# Altium project SLEEPTRACK2_PHASE3.PrjPcb
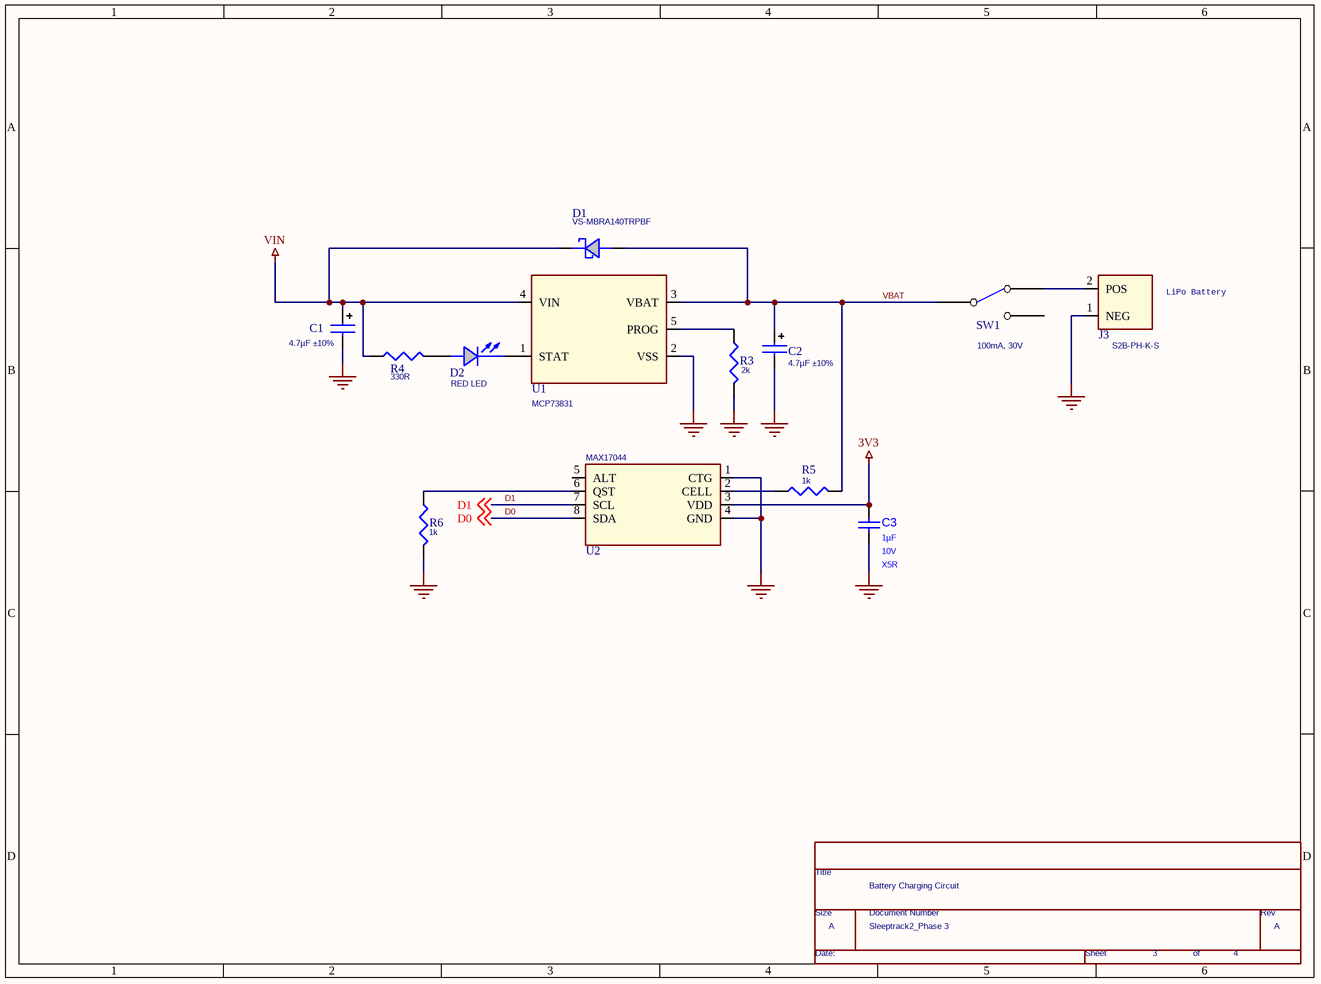
[diagram p0: P03_Battery Circuit.SchDoc]
8 sheets, 44 parts. Net scope: global (net labels, ports and power ports of the same name join across sheets).
Sheets:
  P03_Battery Circuit.SchDoc
  P01_Title .SchDoc
  P02_Photon.SchDoc
  P04_Connectors.SchDoc
  P05_BNO055.SchDoc
  P06_Audio .SchDoc
  P07_ BNO055 External.SchDoc
  P08_BNO055 TH.SchDoc

## Sheet P03_Battery Circuit.SchDoc
size 246 x 182 mm

### Parts
(Parts that share a designator on the sheet are numbered #1, #2 ... from top to bottom, then left to right.)
*#1  Doc: Sleeptrack2_Phase 3  RevCode: A  Title: Battery Charging Circuit  Page Number: 3  Page Count: 4  (hidden comment: TitleBlock0)  (graphical)
C1  4.7µF ±10%  [CAPCP1206]
C2  4.7µF ±10%  [CAPCP1206]
C3  ValueDisplayed: 1µF  Value2: 10V  TempCo: X5R  [0402]  (hidden comment: GRM155R61A105KE15D)
D1  VS-MBRA140TRPBF  [D0-214AC]
D2  RED LED  [LED0402N]
J3  S2B-PH-K-S  [S2B-PH-K-S]
R3  2k  [RESC402N]
R4  330R  [RESC402N]
R5#1  1k  [RESC402N]
R6#1  1k  [RESC402N]
SW1  100mA, 30V  [SS12DH2]
U1  MCP73831  [SOT95P270X145-5N]
U2  MAX17044  [SON50P300X100_HS-9M]

### Nets
3V3: C1.2 C2.2 C3.1 C3.2 J3.1(NEG) R3.2 R6#1.2 U1.2(VSS) U2.1(CTG) U2.3(VDD) U2.4(GND)  [also labelled GND]
VIN: C1.1 D1.2(CATHODE) R4.1 U1.4(VIN)  [project net Photon_VIN]
D0: U2.8(SDA) ; off-sheet D0
D1: U2.7(SCL) ; off-sheet D1
VBAT: C2.1 D1.1(ANODE) R5#1.2 SW1.1(COMMON) U1.3(VBAT)
NetD2_1: D2.1(CATHODE) U1.1(STAT)
NetD2_2: D2.2(ANODE) R4.2
NetJ3_2: J3.2(POS) SW1.3(NO)
NetR3_1: R3.1 U1.5(PROG)
NetR5#1_1: R5#1.1 U2.2(CELL)
NetR6#1_1: R6#1.1 U2.6(QST)

Not connected (* = marked no-connect by the designer): SW1 2(NC); U2 5(ALT)

### Notes on the sheet
- LiPo Battery
- (in symbol TitleBlock0) Title; Size; Document Number; Rev; Date:; Sheet; of

### Library data of the parts
C1 C2 = 4.7µF ±10% Molded Tantalum Capacitors 6.3V 1206 (3216 Metric) 6 Ohm: T491A475K006AT
C3 = GRM155R61A105KE15D: CAP, CERM, 1 µF, 10 V, +/- 10%, X5R, 0402; Manufacturer: MuRata; Polarized: N; CompType: Capacitor; Value: 1uF; U/M: EA; Cap_F: 0.000001; Tolerance_%: 10; Value1: Unknown; TaMin_C: -55; TaMax_C: 85; AEC Category: Q200; SymbolVersion: 2008-07-09; PartNumber: GRM155R61A105KE15D; PackageReference: 0402; RoHS: Y; VDC_V: 10; MountType: SMT; Technology: Ceramic; Cap_Case: 0402; Published: 2008-06-19; Publisher: Texas Instruments; LatestRevisionDate: 2016-01-22; ComponentLink1Description: Datasheet link; ComponentLink1URL: http://search.murata.co.jp/Ceramy/PnsearchViewAction.do?HnOFG=ON&HnNFG=ON&SEL_CNT=50&sLang=en&sKey=GRM155R61A105KE15D&x=9&y=9&search=startwith; Supplier 1: Digi-Key; Supplier Part Number 1: 490-3890-1-ND; Supplier 2: Mouser; Supplier Part Number 2: 81-GRM155R61A105KE15; Supplier 3: Farnell; Supplier Part Number 3: 1735523; AEC Qualified: ?
D1 = VS-MBRA140TRPBF: Diode Schottky 40V 1A Surface Mount SMA
D2 = VLMS1500-GS08: Red 631nm LED Indication - Discrete 2V 0402 (1005 Metric)
J3 = S2B-PH-K-S: 2 Positions Header, Shrouded Connector 0.079" (2.00mm) Through Hole, Right Angle Tin
R3 = RC0402FR-072KL: RES SMD 2K OHM 1% 1/16W 0402
R4 = RC0402FR-07330RL: RES SMD 330R OHM 1% 1/16W 0402
R5#1 R6#1 = RC0402FR-071KL: RES SMD 1K OHM 1% 1/16W 0402
SW1 = SS12SDH2: Slide Switch SPDT Through Hole, Right Angle
U1 = MCP73831: Charger IC Lithium-Ion/Polymer SOT-23-5
U2 = MAX17044: Battery Battery Monitor IC Lithium-Ion/Polymer 8-TDFN (2x3)
*#1 = TitleBlock0: Page Create Date: March  8, 1995; Page Size: A

## Sheet P01_Title .SchDoc
size 386 x 246 mm
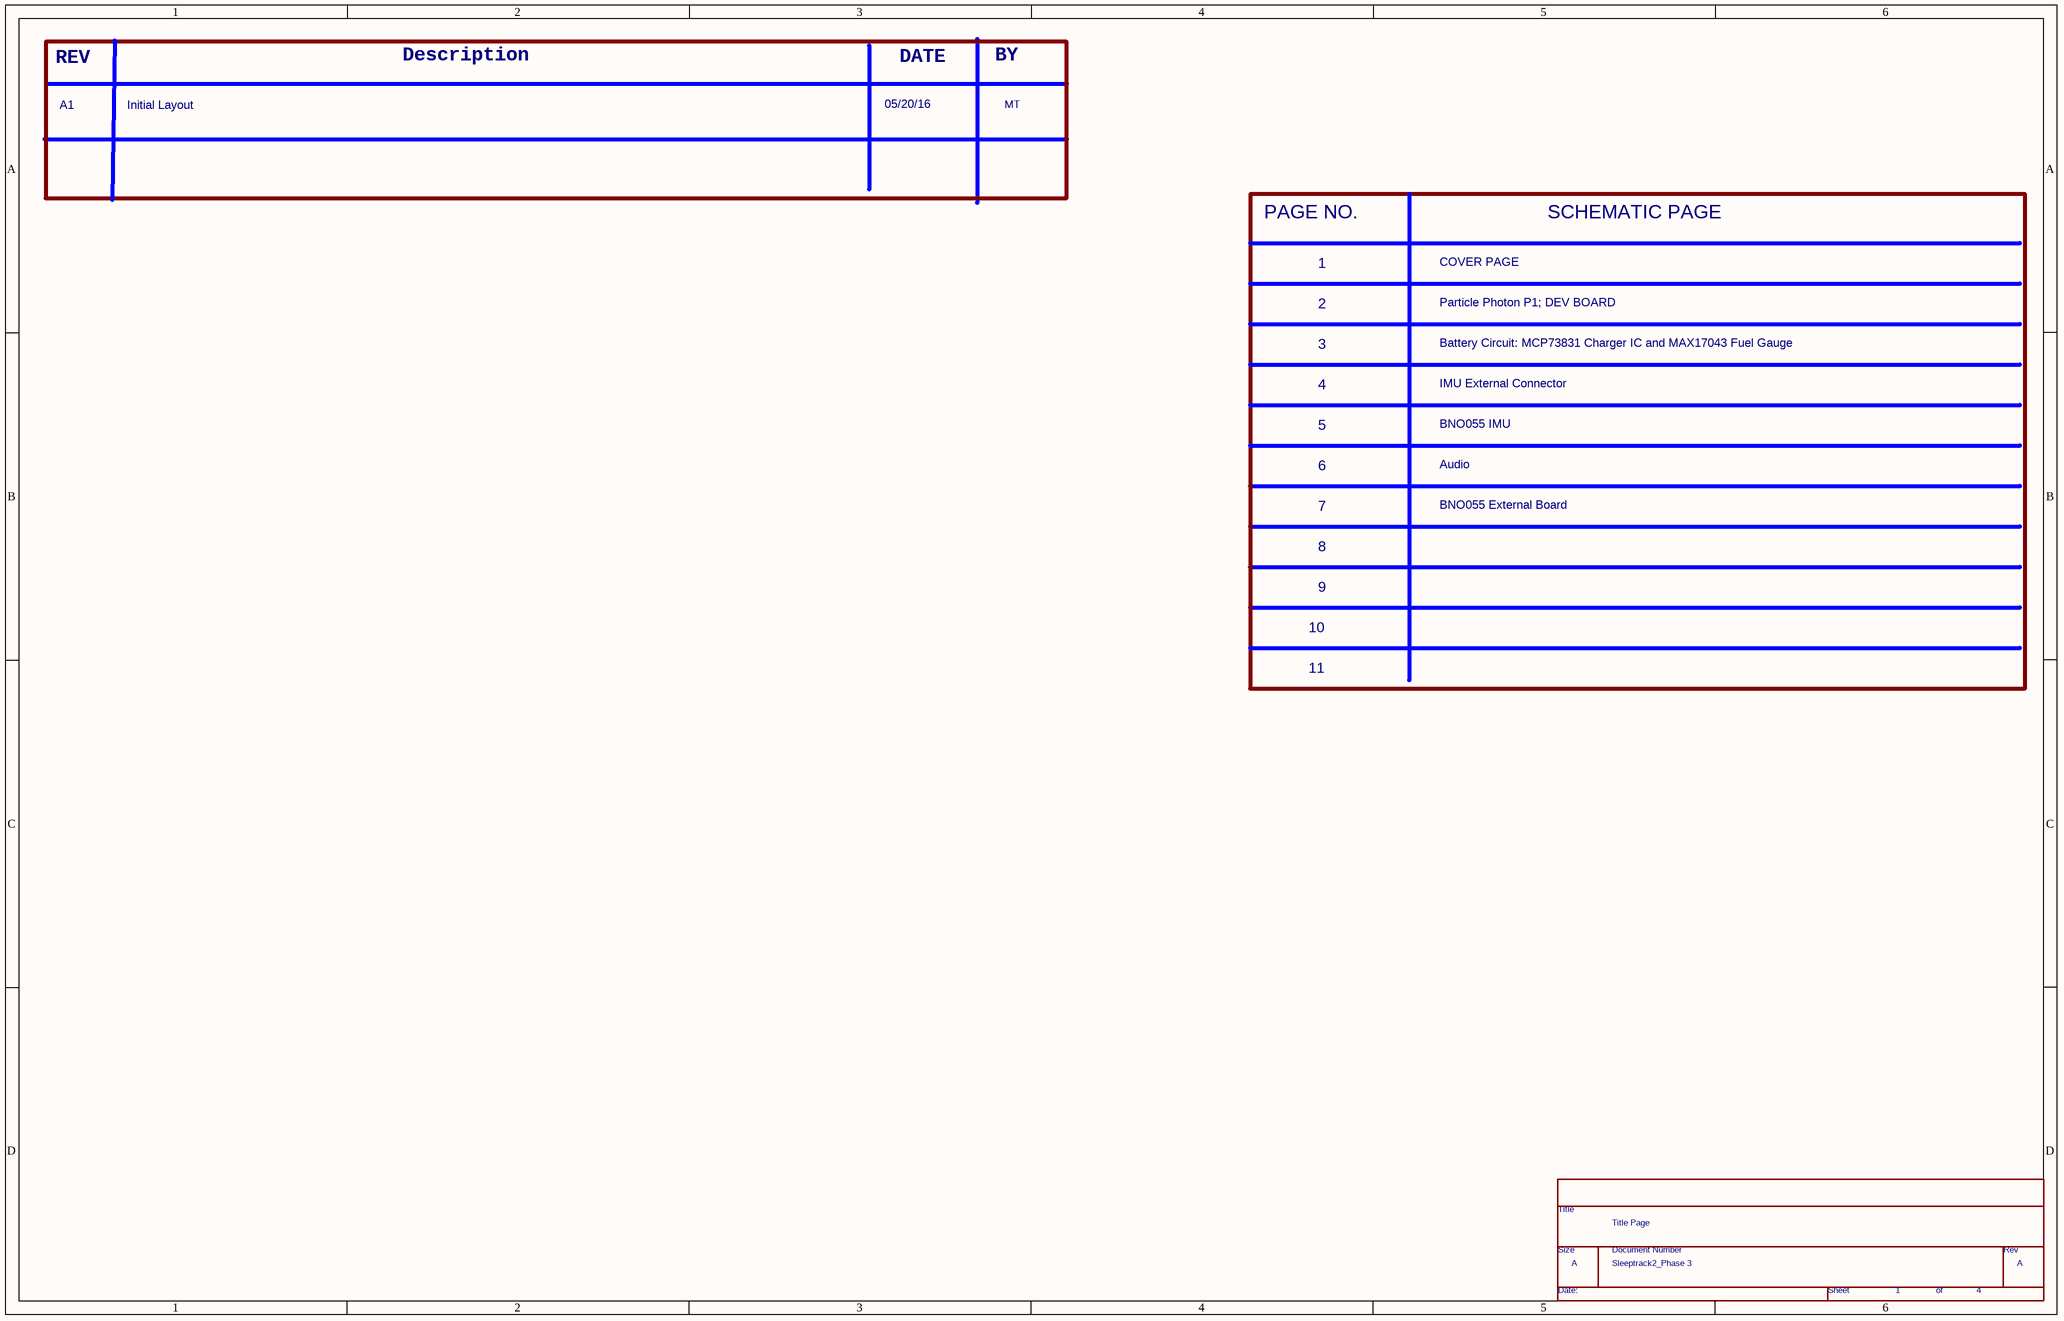
[diagram p1: P01_Title .SchDoc]

### Parts
(Parts that share a designator on the sheet are numbered #1, #2 ... from top to bottom, then left to right.)
*#2  Doc: Sleeptrack2_Phase 3  RevCode: A  Title: Title Page  Page Number: 1  Page Count: 4  (hidden comment: TitleBlock0)  (graphical)

### Notes on the sheet
- REV
- A1
- Initial Layout
- Description
- 05/20/16
- DATE
- BY
- MT
- PAGE NO.
- SCHEMATIC PAGE
- 1
- 2
- Particle Photon P1; DEV BOARD
- COVER PAGE
- 3
- 4
- IMU External Connector
- Battery Circuit: MCP73831 Charger IC and MAX17043 Fuel Gauge
- 5
- BNO055 IMU
- 7
- 6
- Audio
- BNO055 External Board
- 8
- 9
- 10
- 11
- (in symbol TitleBlock0) Title; Size; Document Number; Rev; Date:; Sheet; of

### Library data of the parts
*#2 = TitleBlock0: Page Create Date: March  8, 1995; Page Size: A

## Sheet P02_Photon.SchDoc
size 246 x 182 mm
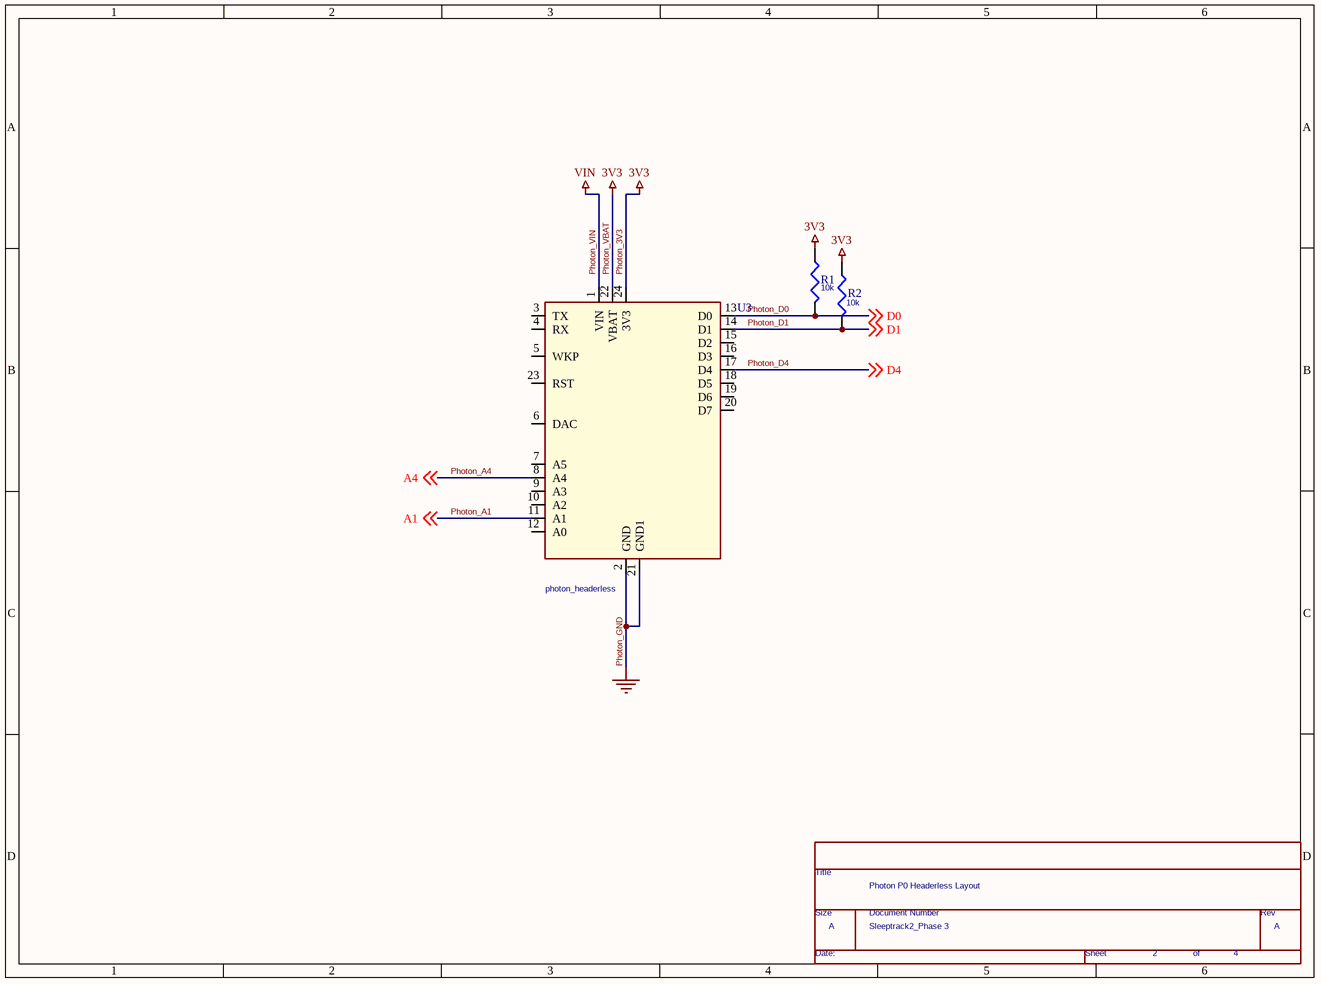
[diagram p2: P02_Photon.SchDoc]

### Parts
(Parts that share a designator on the sheet are numbered #1, #2 ... from top to bottom, then left to right.)
*#3  Doc: Sleeptrack2_Phase 3  RevCode: A  Title: Photon P0 Headerless Layout  Page Number: 2  Page Count: 4  (hidden comment: TitleBlock0)  (graphical)
R1  10k  [RESC402N]
R2  10k  [RESC402N]
U3  photon_headerless  [Photon P0 - duplicate]

### Nets
3V3: R1.1 R2.1 U3.2(GND) U3.21(GND1) U3.22(VBAT) U3.24(3V3)  [also labelled GND, Photon_3V3, Photon_GND, Photon_VBAT]
Photon_VIN: U3.1(VIN)  [also labelled VIN]
A4: U3.8(A4) ; off-sheet A4  [also labelled Photon_A4]
D0: R1.2 U3.13(D0) ; off-sheet D0  [also labelled Photon_D0]
D1: R2.2 U3.14(D1) ; off-sheet D1  [also labelled Photon_D1]
Photon_A1: U3.11(A1) ; off-sheet A1  [also labelled A1]
Photon_D4: U3.17(D4) ; off-sheet D4  [also labelled D4]

Not connected (* = marked no-connect by the designer): U3 3(TX) 4(RX) 5(WKP) 6(DAC) 7(A5) 9(A3) 10(A2) 12(A0) 15(D2) 16(D3) 18(D5) 19(D6) 20(D7) 23(RST)

### Notes on the sheet
- (in symbol TitleBlock0) Title; Size; Document Number; Rev; Date:; Sheet; of

### Library data of the parts
R1 R2 = RC0402FR-0710KL: RES SMD 10K OHM 1% 1/16W 0402
*#3 = TitleBlock0: Page Create Date: March  8, 1995; Page Size: A

## Sheet P04_Connectors.SchDoc
size 246 x 182 mm
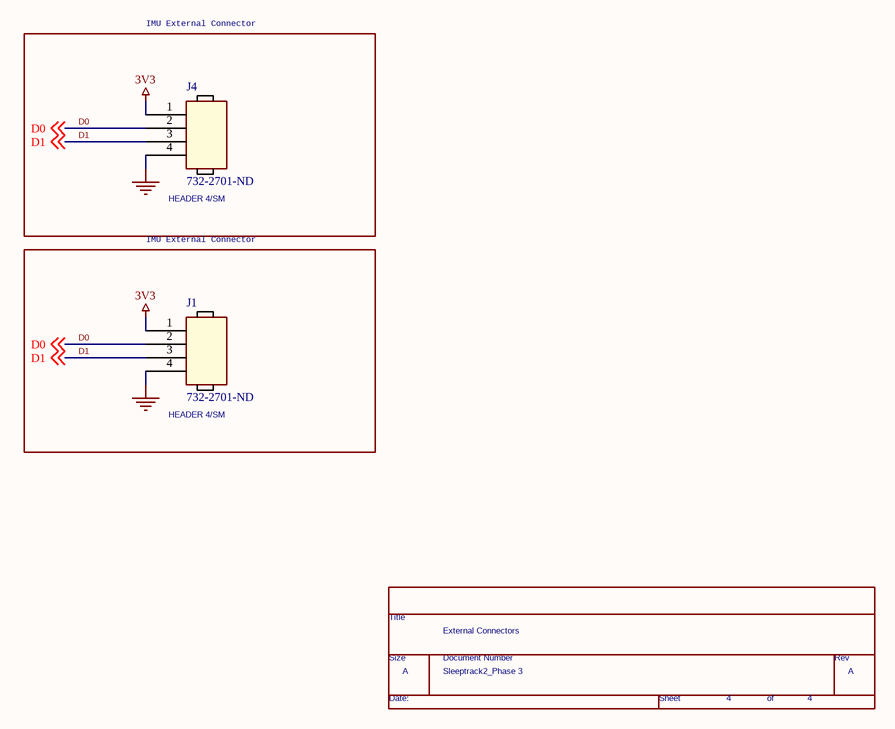
[diagram p3: P04_Connectors.SchDoc]

### Parts
(Parts that share a designator on the sheet are numbered #1, #2 ... from top to bottom, then left to right.)
*#4  Doc: Sleeptrack2_Phase 3  RevCode: A  Title: External Connectors  Page Number: 4  (hidden comment: TitleBlock0)  (graphical)
J1  HEADER 4/SM  Supplier Part Number 1: 732-2701-ND  [61900411021]
J4  HEADER 4/SM  Supplier Part Number 1: 732-2701-ND  [61900411021]

### Blocks framed on the sheet
IMU External Connector: J4
IMU External Connector: J1

### Nets
3V3: J1.1 J1.4 J4.1 J4.4  [also labelled GND]
D0: J1.2 J4.2 ; off-sheet D0
D1: J1.3 J4.3 ; off-sheet D1

### Notes on the sheet
- (in symbol TitleBlock0) Title; Size; Document Number; Rev; Date:; Sheet; of

### Library data of the parts
J1 J4 = HEADER 4/SM: 61900411021; Manufacturer: Wurth Electronics Inc.; Shrouding: Shrouded - 1 Wall; Material Flammability Rating: UL94 V-0; Description: HEADER 4POS PIN R/A 2.54MM T/H; Style: Board to Cable/Wire; Pitch - Mating: 0.100" (2.54mm); Current Rating: 3A; Voltage Rating: 250V; Number of Positions Loaded: All; Number of Positions: 4; Contact Length - Post: 0.134" (3.40mm); Contact Length - Mating: 0.300" (7.62mm); Supplier 1: Digi-Key; Connector Type: Header; Operating Temperature: -40°C ~ 105°C; Contact Type: Male Pin; Features: -; Contact Finish - Post: Tin; Manufacturer Part Number: 61900411021; Category: Connectors, Interconnects; Fastening Type: Friction Lock; Insulation Color: Beige; Insulation Material: Polyamide (PA66), Nylon 6/6; Contact Shape: Square; Contact Finish - Mating: Tin; Contact Finish Thickness - Mating: -; Number of Rows: 1; Packaging: Bulk; Supplier: Digi-Key; Ingress Protection: -; Insulation Height: 0.228" (5.80mm); Termination: Solder; Mated Stacking Heights: -; Applications: -; Overall Contact Length: -; Row Spacing - Mating: -; Part Status: Active; Contact Finish Thickness - Post: -; Mounting Type: Through Hole, Right Angle; RoHS: RoHS Compliant; Contact Material: Copper Alloy
*#4 = TitleBlock0: Page Create Date: March  8, 1995; Page Size: A; Page Count: 4

## Sheet P05_BNO055.SchDoc
size 246 x 182 mm
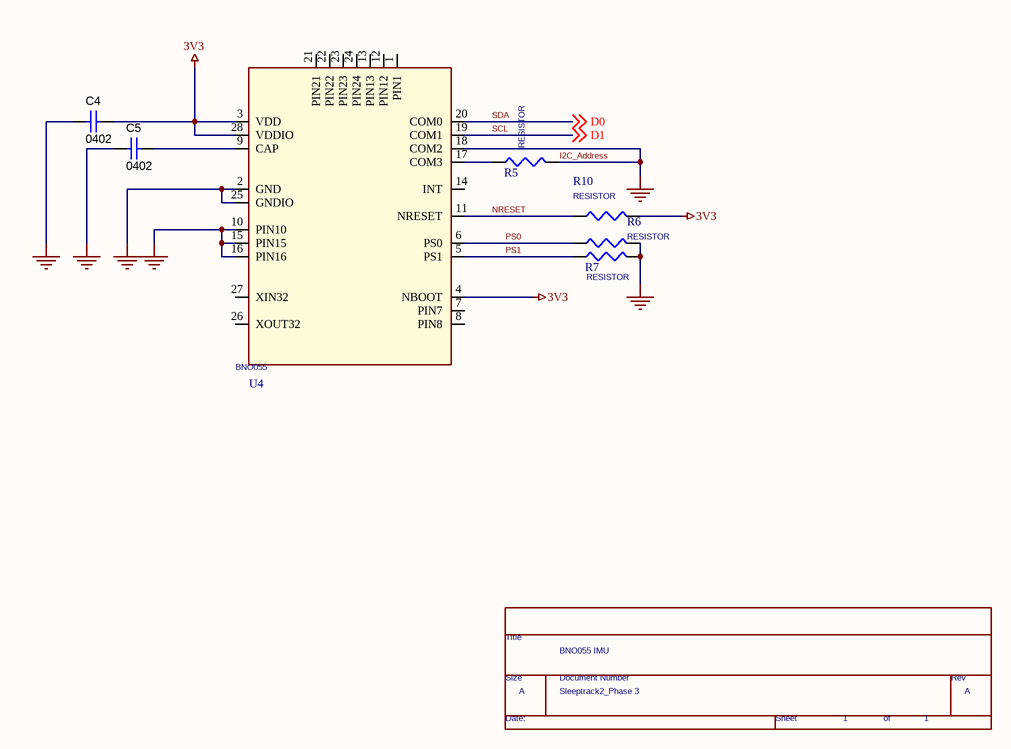
[diagram p4: P05_BNO055.SchDoc]

### Parts
(Parts that share a designator on the sheet are numbered #1, #2 ... from top to bottom, then left to right.)
*#5  Doc: Sleeptrack2_Phase 3  RevCode: A  Title: BNO055 IMU  Page Number: 1  (hidden comment: TitleBlock0)  (graphical)
C4  Cap_Case: 0402  [0402L]  (hidden comment: 885012205037)
C5  Cap_Case: 0402  [0402L]  (hidden comment: 885012205037)
R5#2  RESISTOR
R6#2  RESISTOR
R7  RESISTOR
R10  RESISTOR
U4  BNO055  [LCCS50P520X380X118-28N]

### Nets
3V3: C4.1 C4.2 C5.2 R5#2.2 R6#2.2 R7.2 R10.2 U4.2(GND) U4.3(VDD) U4.4(NBOOT) U4.10(PIN10) U4.15(PIN15) U4.16(PIN16) U4.18(COM2) U4.25(GNDIO) U4.28(VDDIO)  [also labelled GND, I2C_Address]
D0: U4.20(COM0) ; off-sheet D0  [also labelled SDA]
D1: U4.19(COM1) ; off-sheet D1  [also labelled SCL]
NRESET: R10.1 U4.11(NRESET)
PS0: R6#2.1 U4.6(PS0)
PS1: R7.1 U4.5(PS1)
NetC5_1: C5.1 U4.9(CAP)
NetR5#2_1: R5#2.1 U4.17(COM3)

Not connected (* = marked no-connect by the designer): U4 1(PIN1) 7(PIN7) 8(PIN8) 12(PIN12) 13(PIN13) 14(INT) 21(PIN21) 22(PIN22) 23(PIN23) 24(PIN24) 26(XOUT32) 27(XIN32)

### Notes on the sheet
- (in symbol TitleBlock0) Title; Size; Document Number; Rev; Date:; Sheet; of

### Library data of the parts
C4 = 885012205037: CAP, CERM, 0.1 µF, 16 V, +/- 10%, X7R, 0402; Manufacturer: Wurth Elektronik; Polarized: N; CompType: Capacitor; Value: 0.1uF; ValueDisplayed: 0.1µF; U/M: EA; Cap_F: 0.0000001; Tolerance_%: 10; Value1: Unknown; VDC_V: 16; Value2: 16V; TaMin_C: -55; TaMax_C: 125; AEC Category: Q200; SymbolVersion: 2008-07-09; PartNumber: 885012205037; PackageReference: 0402; RoHS: Y; MountType: SMT; Technology: Ceramic; TempCo: X7R; Published: 2008-06-19; Publisher: Texas Instruments; LatestRevisionDate: 2016-02-01; ComponentLink1Description: Datasheet link; ComponentLink1URL: http://katalog.we-online.de/pbs/datasheet/885012205037.pdf; Supplier 1: Digi-Key; Supplier Part Number 1: 732-7532-1-ND; Supplier 2: Mouser; Supplier Part Number 2: 710-885012205037; AEC Qualified: N; AEC Grade: N/A
C5 = 885012205037: CAP, CERM, 0.1 µF, 16 V, +/- 10%, X7R, 0402; Manufacturer: Wurth Elektronik; Polarized: N; CompType: Capacitor; Value: 0.1uF; U/M: EA; Cap_F: 0.0000001; Tolerance_%: 10; Value1: Unknown; VDC_V: 16; TaMin_C: -55; TaMax_C: 125; AEC Category: Q200; ValueDisplayed: 0.1µF; Value2: 16V; SymbolVersion: 2008-07-09; PartNumber: 885012205037; PackageReference: 0402; RoHS: Y; MountType: SMT; Technology: Ceramic; Published: 2008-06-19; Publisher: Texas Instruments; LatestRevisionDate: 2016-02-01; ComponentLink1Description: Datasheet link; ComponentLink1URL: http://katalog.we-online.de/pbs/datasheet/885012205037.pdf; Supplier 1: Digi-Key; Supplier Part Number 1: 732-7532-1-ND; Supplier 2: Mouser; Supplier Part Number 2: 710-885012205037; AEC Qualified: N; AEC Grade: N/A; TempCo: X7R
*#5 = TitleBlock0: Page Create Date: March  8, 1995; Page Size: A; Page Count: 1

## Sheet P06_Audio .SchDoc
size 246 x 182 mm
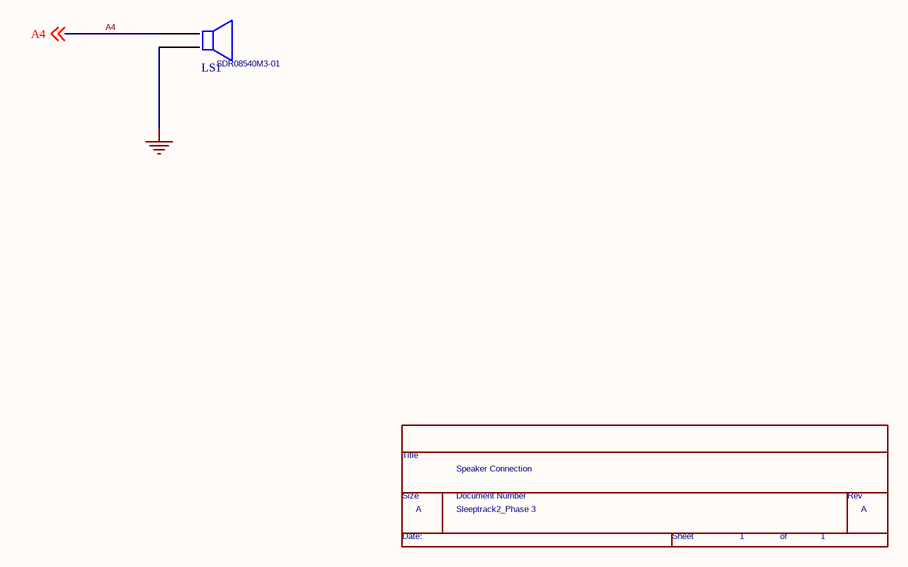
[diagram p5: P06_Audio .SchDoc]

### Parts
(Parts that share a designator on the sheet are numbered #1, #2 ... from top to bottom, then left to right.)
*#6  Doc: Sleeptrack2_Phase 3  RevCode: A  Title: Speaker Connection  Page Number: 1  (hidden comment: TitleBlock0)  (graphical)
LS1  SDR08540M3-01  [SDR08540M3-01]

### Nets
GND: LS1.2  [project net 3V3]
A4: LS1.1 ; off-sheet A4

### Notes on the sheet
- (in symbol TitleBlock0) Title; Size; Document Number; Rev; Date:; Sheet; of

### Library data of the parts
LS1 = SDR08540M3-01: Speakers & Transducers 88dB 85mA 3volts 2670Hz
*#6 = TitleBlock0: Page Create Date: March  8, 1995; Page Size: A; Page Count: 1

## Sheet P07_ BNO055 External.SchDoc
size 246 x 182 mm
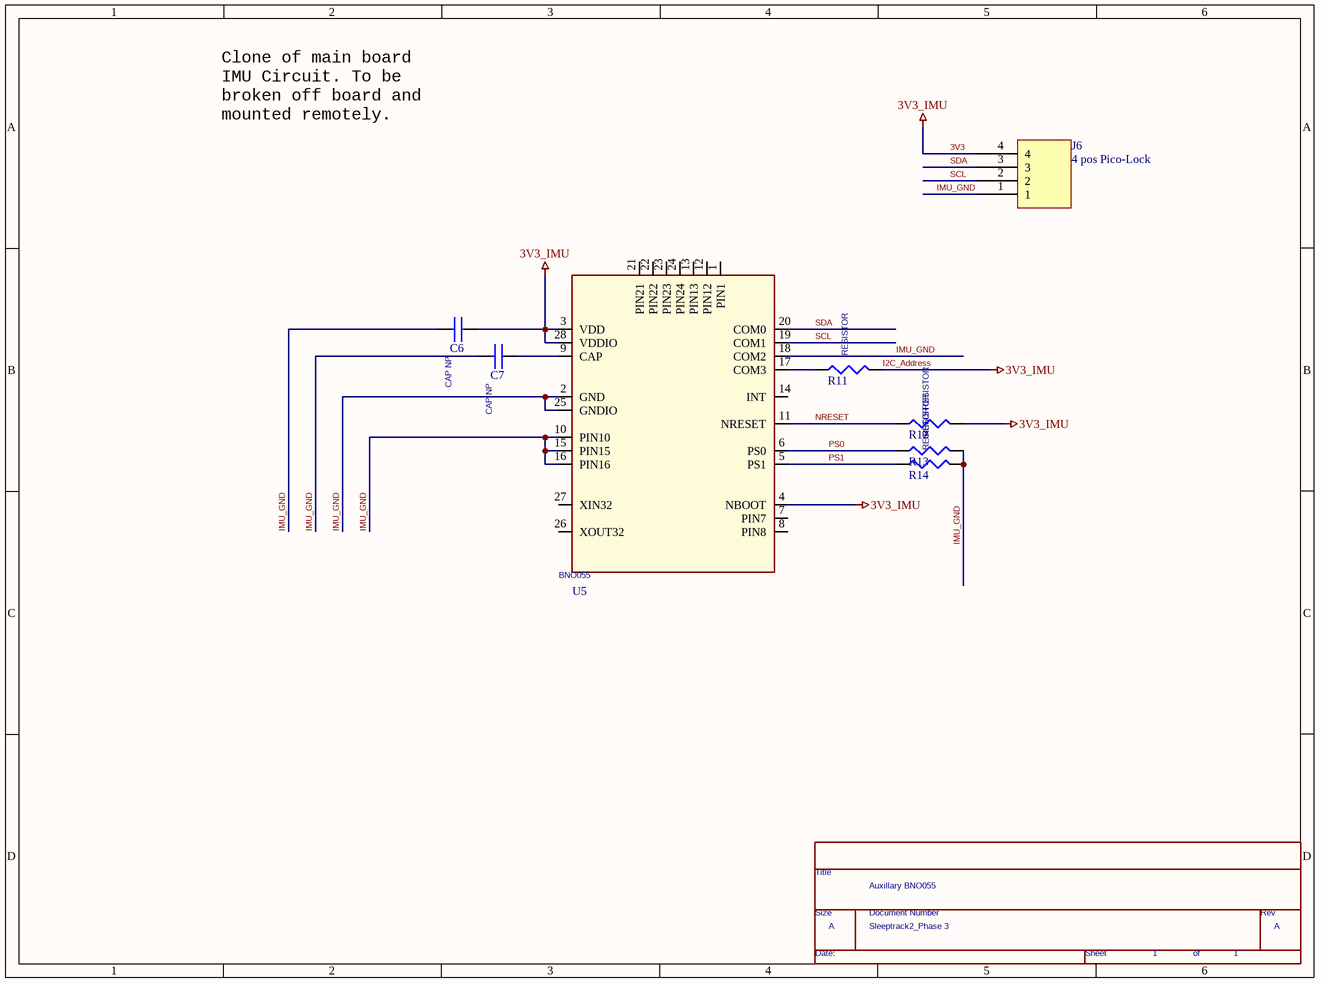
[diagram p6: P07_ BNO055 External.SchDoc]

### Parts
(Parts that share a designator on the sheet are numbered #1, #2 ... from top to bottom, then left to right.)
*#7  Doc: Sleeptrack2_Phase 3  RevCode: A  Title: Auxillary BNO055  Page Number: 1  (hidden comment: TitleBlock0)  (graphical)
C6  CAP NP
C7  CAP NP
J6  4 pos Pico-Lock  [5037630491]
R11  RESISTOR
R12  RESISTOR
R13  RESISTOR
R14  RESISTOR
U5  BNO055  [LCCS50P520X380X118-28N]

### Nets
3V3: C6.1 J6.4 R11.2 R12.2 U5.3(VDD) U5.4(NBOOT) U5.28(VDDIO)  [also labelled 3V3_IMU, I2C_Address]
IMU_GND: C6.2 C7.2 J6.1 R13.2 R14.2 U5.2(GND) U5.10(PIN10) U5.15(PIN15) U5.16(PIN16) U5.18(COM2) U5.25(GNDIO)
NRESET: R12.1 U5.11(NRESET)
PS0: R13.1 U5.6(PS0)
PS1: R14.1 U5.5(PS1)
SCL: J6.2 U5.19(COM1)  [project net D1]
SDA: J6.3 U5.20(COM0)  [project net D0]
NetC7_1: C7.1 U5.9(CAP)
NetR11_1: R11.1 U5.17(COM3)

Not connected (* = marked no-connect by the designer): J6 MH1(5) MH2(6); U5 1(PIN1) 7(PIN7) 8(PIN8) 12(PIN12) 13(PIN13) 14(INT) 21(PIN21) 22(PIN22) 23(PIN23) 24(PIN24) 26(XOUT32) 27(XIN32)

### Notes on the sheet
- Clone of main board
  IMU Circuit. To be
  broken off board and
  mounted remotely.
- (in symbol TitleBlock0) Title; Size; Document Number; Rev; Date:; Sheet; of

### Library data of the parts
J6 = 5037630491: 4 Positions Header, Shrouded Connector 0.039" (1.00mm) Surface Mount, Right Angle Gold
*#7 = TitleBlock0: Page Create Date: March  8, 1995; Page Size: A; Page Count: 1

## Sheet P08_BNO055 TH.SchDoc
size 246 x 182 mm
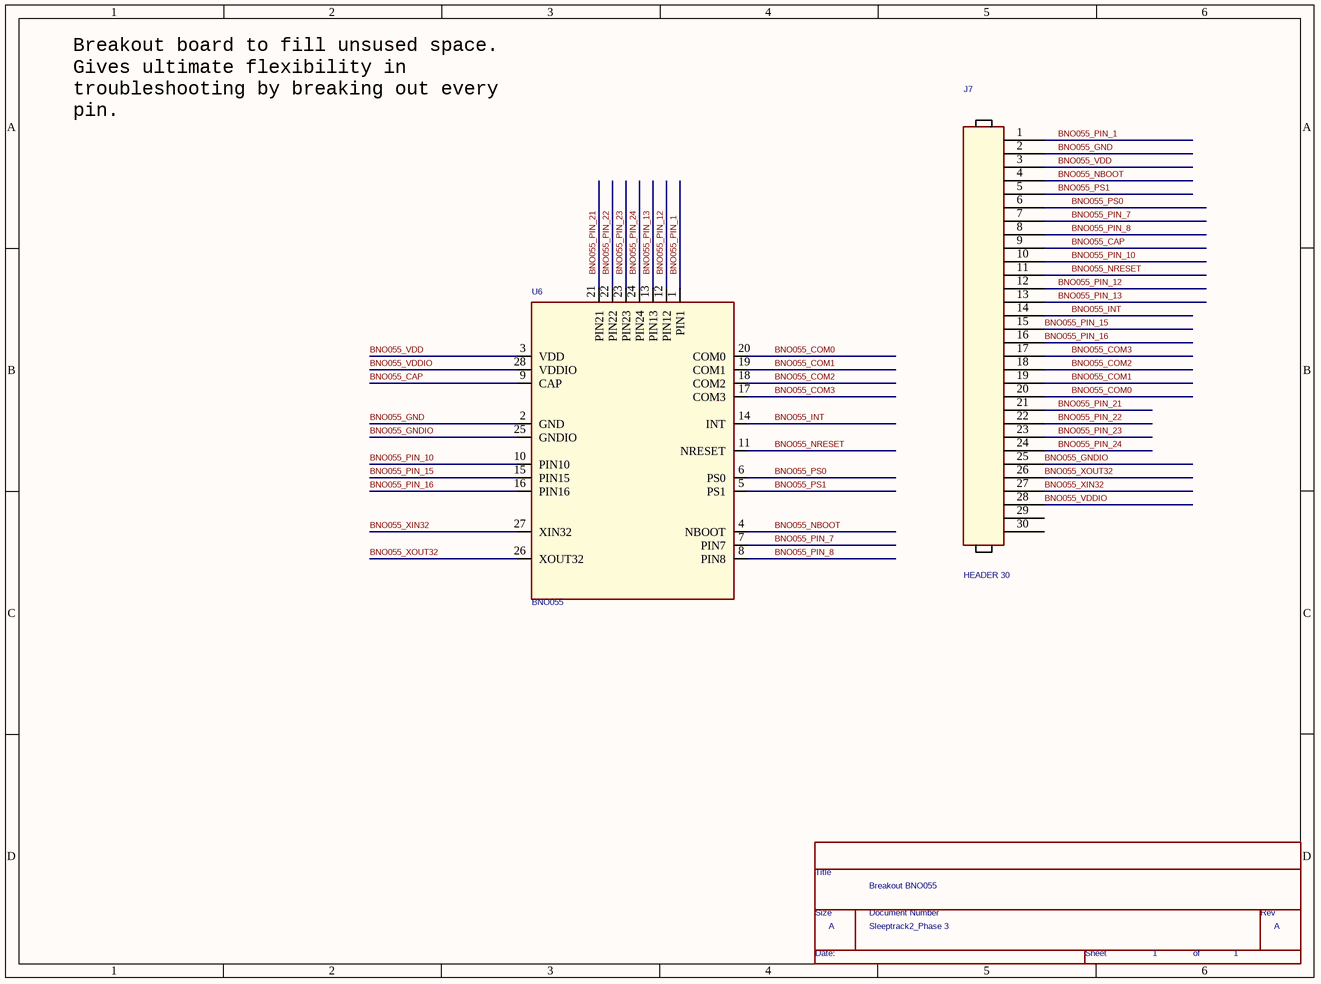
[diagram p7: P08_BNO055 TH.SchDoc]

### Parts
(Parts that share a designator on the sheet are numbered #1, #2 ... from top to bottom, then left to right.)
*#8  Doc: Sleeptrack2_Phase 3  RevCode: A  Title: Breakout BNO055  Page Number: 1  (hidden comment: TitleBlock0)  (graphical)
J7  HEADER 30  [30mini]
U6  BNO055  [bno055]

### Nets
BNO055_CAP: J7.9 U6.9(CAP)
BNO055_COM0: J7.20 U6.20(COM0)
BNO055_COM1: J7.19 U6.19(COM1)
BNO055_COM2: J7.18 U6.18(COM2)
BNO055_COM3: J7.17 U6.17(COM3)
BNO055_GND: J7.2 U6.2(GND)
BNO055_GNDIO: J7.25 U6.25(GNDIO)
BNO055_INT: J7.14 U6.14(INT)
BNO055_NBOOT: J7.4 U6.4(NBOOT)
BNO055_NRESET: J7.11 U6.11(NRESET)
BNO055_PIN_1: J7.1 U6.1(PIN1)
BNO055_PIN_7: J7.7 U6.7(PIN7)
BNO055_PIN_8: J7.8 U6.8(PIN8)
BNO055_PIN_10: J7.10 U6.10(PIN10)
BNO055_PIN_12: J7.12 U6.12(PIN12)
BNO055_PIN_13: J7.13 U6.13(PIN13)
BNO055_PIN_15: J7.15 U6.15(PIN15)
BNO055_PIN_16: J7.16 U6.16(PIN16)
BNO055_PIN_21: J7.21 U6.21(PIN21)
BNO055_PIN_22: J7.22 U6.22(PIN22)
BNO055_PIN_23: J7.23 U6.23(PIN23)
BNO055_PIN_24: J7.24 U6.24(PIN24)
BNO055_PS0: J7.6 U6.6(PS0)
BNO055_PS1: J7.5 U6.5(PS1)
BNO055_VDD: J7.3 U6.3(VDD)
BNO055_VDDIO: J7.28 U6.28(VDDIO)
BNO055_XIN32: J7.27 U6.27(XIN32)
BNO055_XOUT32: J7.26 U6.26(XOUT32)

Not connected (* = marked no-connect by the designer): J7 29 30

### Notes on the sheet
- Breakout board to fill unsused space.
  Gives ultimate flexibility in
  troubleshooting by breaking out every
  pin.
- (in symbol TitleBlock0) Title; Size; Document Number; Rev; Date:; Sheet; of

### Library data of the parts
*#8 = TitleBlock0: Page Create Date: March  8, 1995; Page Size: A; Page Count: 1

## Nets that join several sheets
3V3: P03_Battery Circuit (11 pins), P02_Photon (6 pins), P04_Connectors (J1.1 J1.4 J4.1 J4.4), P05_BNO055 (16 pins), P06_Audio  (LS1.2), P07_ BNO055 External (7 pins)
Photon_VIN: P03_Battery Circuit (C1.1 D1.2 R4.1 U1.4), P02_Photon (U3.1)
A4: P02_Photon (U3.8), P06_Audio  (LS1.1)
D0: P03_Battery Circuit (U2.8), P02_Photon (R1.2 U3.13), P04_Connectors (J1.2 J4.2), P05_BNO055 (U4.20), P07_ BNO055 External (J6.3 U5.20)
D1: P03_Battery Circuit (U2.7), P02_Photon (R2.2 U3.14), P04_Connectors (J1.3 J4.3), P05_BNO055 (U4.19), P07_ BNO055 External (J6.2 U5.19)
NRESET: P05_BNO055 (R10.1 U4.11), P07_ BNO055 External (R12.1 U5.11)
PS0: P05_BNO055 (R6#2.1 U4.6), P07_ BNO055 External (R13.1 U5.6)
PS1: P05_BNO055 (R7.1 U4.5), P07_ BNO055 External (R14.1 U5.5)